# Altium schematic sheet FT232.SchDoc
size A4
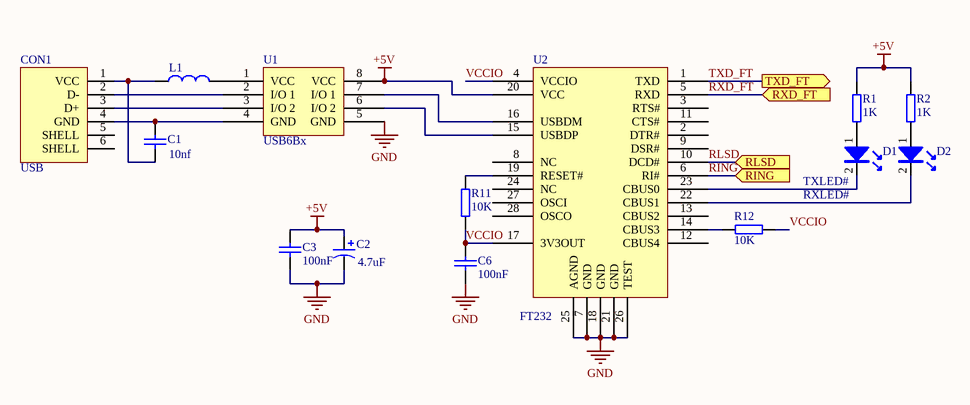
[diagram p0: FT232.SchDoc]

## Parts
C1  value 10nf  [C0603]  (hidden comment: CAP)
C2  value 4.7uF  [T3528]  (hidden comment: CAP+)
C3  value 100nF  [C0603]  (hidden comment: CAP)
C6  value 100nF  [C0603]  (hidden comment: CAP)
CON1  USB  [USB2.5-2H4D]
D1  LED  [D0805]  (value not drawn)
D2  LED  [D0805]  (value not drawn)
L1  INDUCTOR  [L0805]  (value not drawn)
R1  value 1K  [R0603]  (hidden comment: res)
R2  value 1K  [R0603]  (hidden comment: res)
R11  value 10K  [R0603]  (hidden comment: res)
R12  value 10K  [R0603]  (hidden comment: res)
U1  USB6Bx  [SO8]
U2  FT232  [SSOP-28]

## Ports
RING (in), RLSD (in), RXD_FT (in), TXD_FT (out)

## Nets
+5V: C2.1 C3.2 R1.2 R2.2 U1.8(VCC) U2.20(VCC)
GND: C2.2 C3.1 C6.1 U1.5(GND) U2.7(GND) U2.18(GND) U2.21(GND) U2.25(AGND) U2.26(TEST)
RING: U2.6(RI#) ; port RING
RLSD: U2.10(DCD#) ; port RLSD
RXD_FT: U2.5(RXD) ; port RXD_FT
TXD_FT: U2.1(TXD) ; port TXD_FT
VCCIO: C6.2 R11.2 R12.1 U2.4(VCCIO) U2.17(3V3OUT)
NetC1_1: C1.1 CON1.1(VCC) L1.1
NetC1_2: C1.2 CON1.4(GND) U1.4(GND)
NetCON1_2: CON1.2(D-) U1.2(I/O_1)
NetCON1_3: CON1.3(D+) U1.3(I/O_2)
NetD1_1: D1.1 R1.1
NetD1_2: D1.2 U2.23(CBUS0)
NetD2_1: D2.1 R2.1
NetD2_2: D2.2 U2.22(CBUS1)
NetL1_2: L1.2 U1.1(VCC)
NetR11_1: R11.1 U2.19(RESET#)
NetR12_2: R12.2 U2.14(CBUS3)
NetU1_6: U1.6(I/O_2) U2.15(USBDP)
NetU1_7: U1.7(I/O_1) U2.16(USBDM)

Not connected (* = marked no-connect by the designer): CON1 5(SHELL) 6(SHELL); U2 2(DTR#) 3(RTS#) 8(NC) 9(DSR#) 11(CTS#) 12(CBUS4) 13(CBUS2) 24(NC) 27(OSCI) 28(OSCO)

## Notes on the sheet
- (near D1) TXLED#
- RXLED#

## Library data of the parts
C1 C3 C6 = CAP: Capacitor